# Altium project PCB_Project.PrjPcb
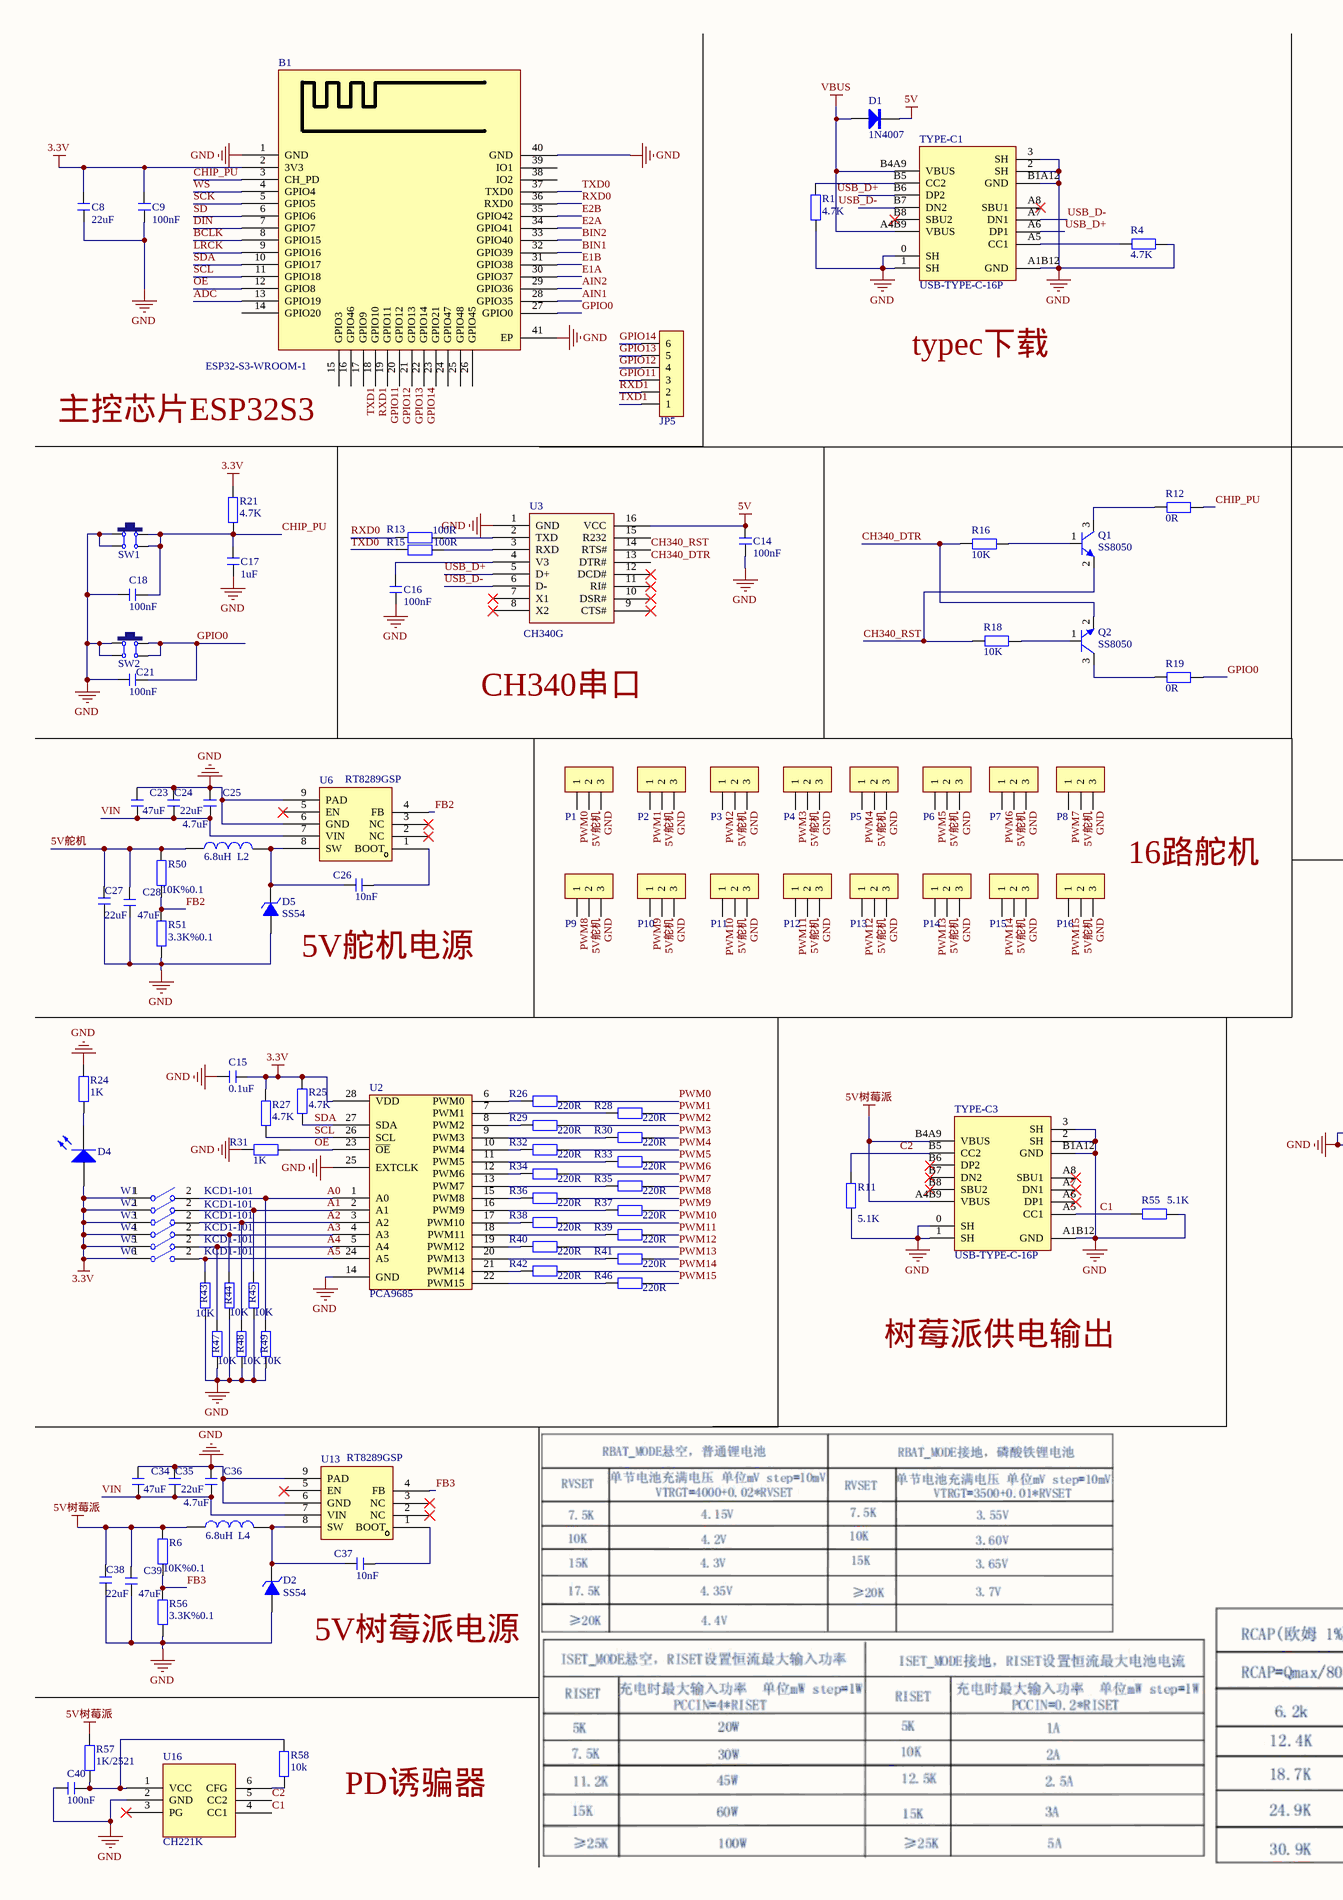
[diagram p0: 1.0v.SchDoc, left]
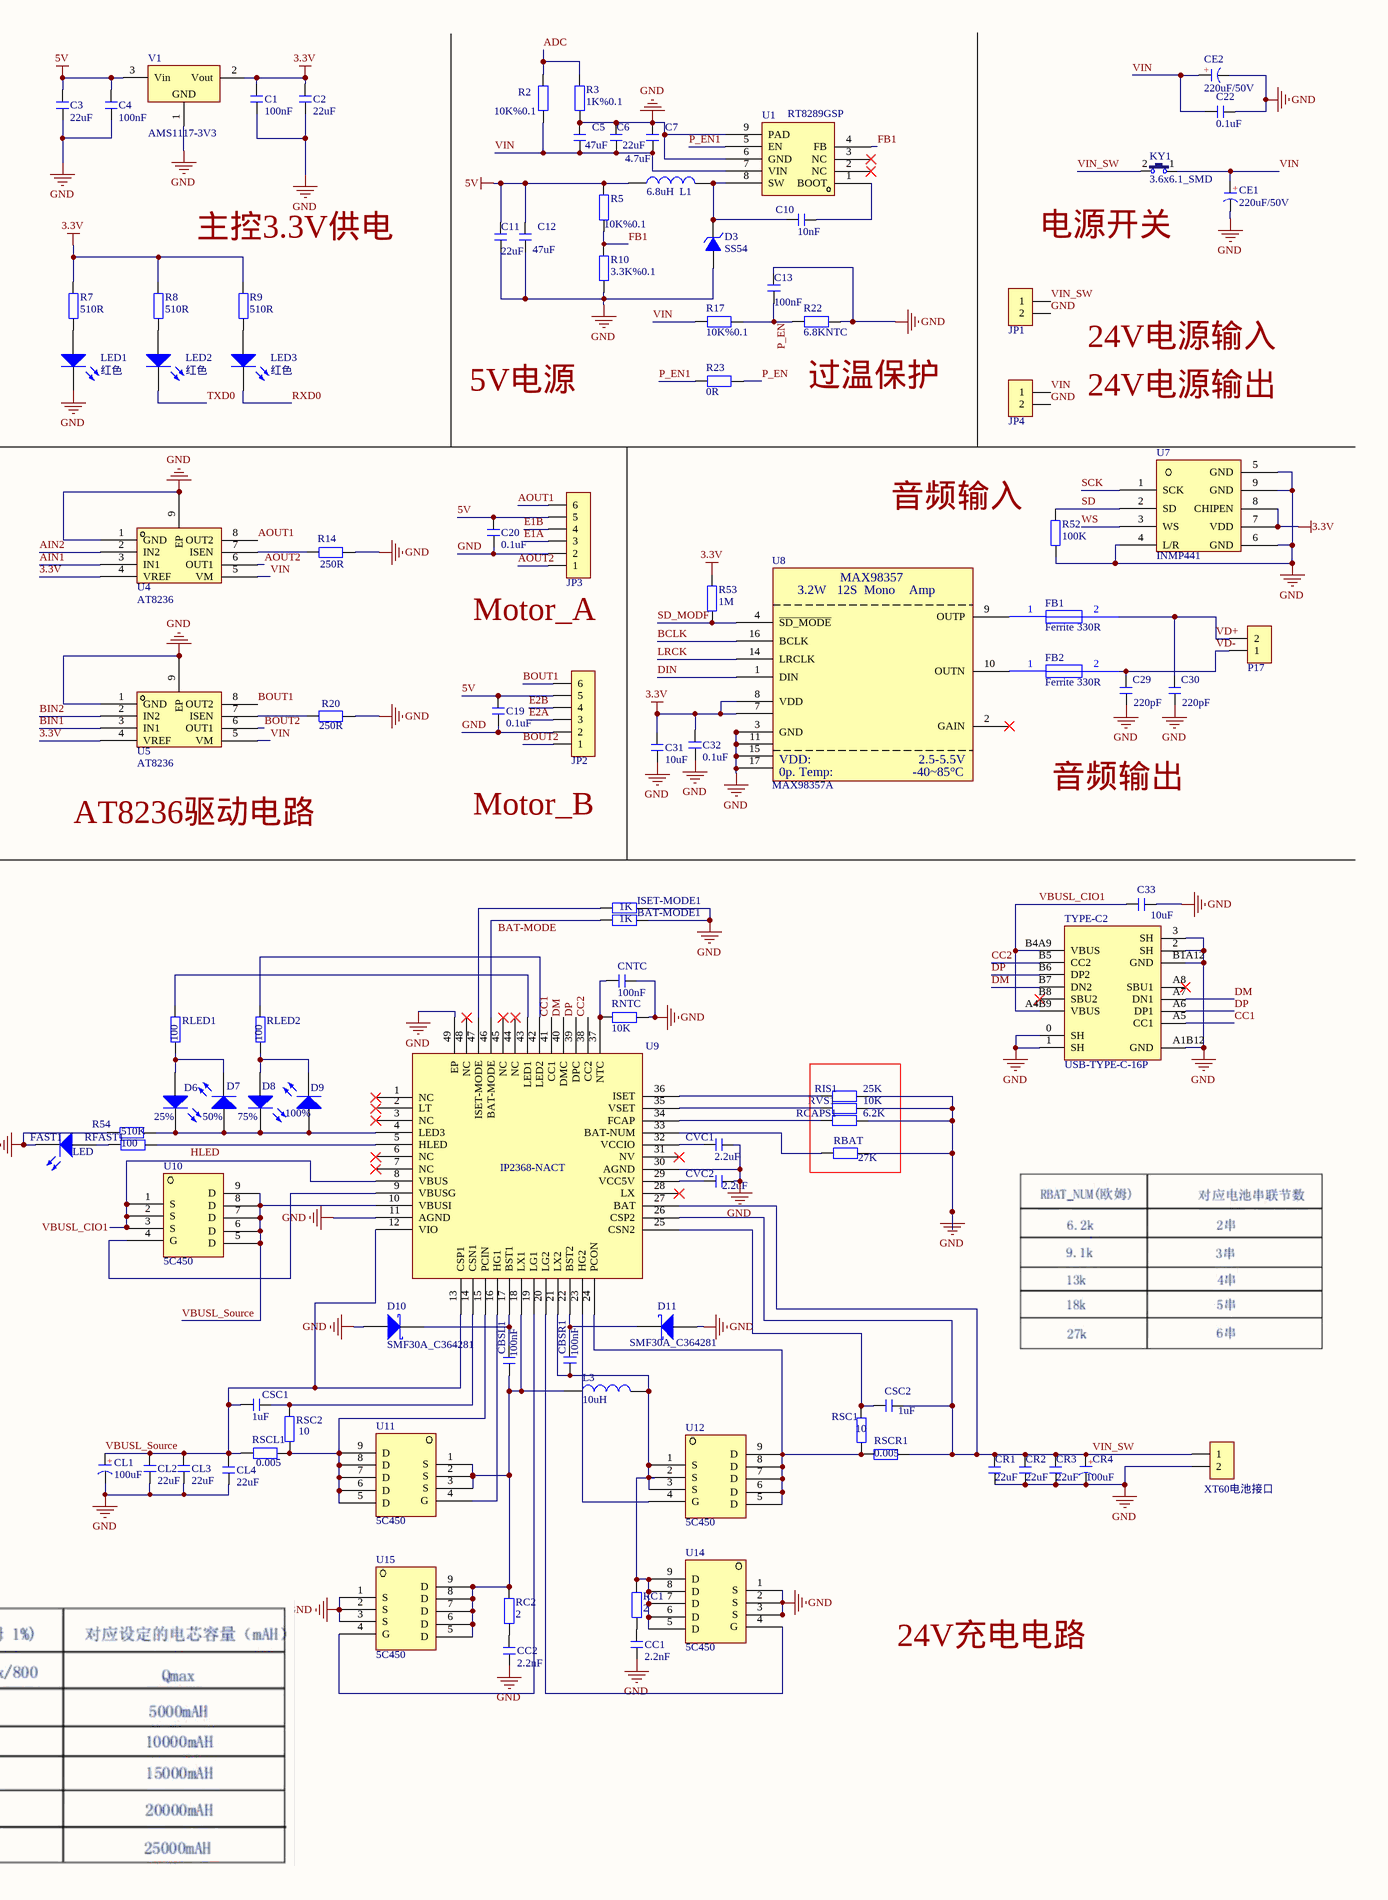
[diagram p1: 1.0v.SchDoc, right]
1 sheet, 209 parts. Net scope: global (net labels, ports and power ports of the same name join across sheets).
Board file: PCB1.PcbDoc

## Sheet 1.0v.SchDoc
size A2; SheetNumber: 1; SheetTotal: 1

### Parts
B1  ESP32-S3-WROOM-1  [WIFIM-SMD_ESP32-WROOM-32D]
BAT-MODE1  1K  [R 0603_L]
C1  100nF  [C 0603_L]
C2  22uF  [C 0805_L]
C3  22uF  [C 0805_L]
C4  100nF  [C 0603_L]
C5  47uF  [C 1210_L]
C6  22uF  [C 1210_L]
C7  4.7uF  [C 0603_L]
C8  22uF  [C 0805_L]
C9  100nF  [C 0603_L]
C10  10nF  [C 0603_L]
C11  22uF  [C 0805_L]
C12  47uF  [C 0805_L]
C13  100nF  [C 0603_L]
C14  100nF  [C 0603_L]
C15  0.1uF  [C 0603_L]
C16  100nF  [C 0603_L]
C17  1uF  [C 0603_L]
C18  100nF  [C 0603_L]
C19  0.1uF  [C 0603_L]
C20  0.1uF  [C 0603_L]
C21  100nF  [C 0603_L]
C22  0.1uF  [C 0603_L]
C23  47uF  [C 1210_L]
C24  22uF  [C 1210_L]
C25  4.7uF  [C 0603_L]
C26  10nF  [C 0603_L]
C27  22uF  [C 0805_L]
C28  47uF  [C 0805_L]
C29  220pF  [C 0603_L]
C30  220pF  [C 0603_L]
C31  10uF  [C 0603_L]
C32  0.1uF  [C 0603_L]
C33  10uF  [C 0603_L]
C34  47uF  [C 1210_L]
C35  22uF  [C 1210_L]
C36  4.7uF  [C 0603_L]
C37  10nF  [C 0603_L]
C38  22uF  [C 0805_L]
C39  47uF  [C 0805_L]
C40  100nF  [C 0603_L]
CBSL1  100nF  [C 0603_L]
CBSR1  100nF  [C 0603_L]
CC1  2.2nF  [C 0603_L]
CC2  2.2nF  [C 0603_L]
CE1  220uF/50V  [CM F(10*10.2)]
CE2  220uF/50V  [CM F(10*10.2)]
CL1  100uF  [CM E(8*10.2)]
CL2  22uF  [C 1210_L]
CL3  22uF  [C 1210_L]
CL4  22uF  [C 1210_L]
CNTC  100nF  [C 0603_L]
CR1  22uF  [C 1210_L]
CR2  22uF  [C 1210_L]
CR3  22uF  [C 1210_L]
CR4  100uF  [CM E(8*10.2)]
CSC1  1uF  [C 0603_L]
CSC2  1uF  [C 0603_L]
CVC1  2.2uF  [C 0603_L]
CVC2  2.2uF  [C 0603_L]
D1  1N4007  [SMA]
D2  SS54  [SMA]
D3  SS54  [SMA]
D4  LED  [LED 0603G]  (value not drawn)
D5  SS54  [SMA]
D6  25%  [LED 0603G]
D7  50%  [LED 0603G]
D8  75%  [LED 0603G]
D9  100%  [LED 0603G]
D10  SMF30A_C364281  [SOD-123F]
D11  SMF30A_C364281  [SOD-123F]
FAST1  LED  [LED 0603G]
FB1  Ferrite 330R  [R 0603_L]
FB2  Ferrite 330R  [R 0603_L]
ISET-MODE1  1K  [R 0603_L]
JP1  HDR-1X2  [HDR2.54-M-LI-2P]  (value not drawn)
JP2  HDR-1X6  [HDR2.54-M-LI-6P]  (value not drawn)
JP3  HDR-1X6  [HDR2.54-M-LI-6P]  (value not drawn)
JP4  HDR-1X2  [HDR2.54-M-LI-2P]  (value not drawn)
JP5  HDR-1X6  [HDR2.54-M-LI-6P]  (value not drawn)
KY1  3.6x6.1_SMD  [SS-12F23]
L1  6.8uH  [CD73]
L2  6.8uH  [CD73]
L3  10uH  [PQ2012]
L4  6.8uH  [CD73]
LED1  红色  [LED 0603R]
LED2  红色  [LED 0603R]
LED3  红色  [LED 0603R]
P1  HDR-1X3  [XH2.54-LI-3P]  (value not drawn)
P2  HDR-1X3  [XH2.54-LI-3P]  (value not drawn)
P3  HDR-1X3  [XH2.54-LI-3P]  (value not drawn)
P4  HDR-1X3  [XH2.54-LI-3P]  (value not drawn)
P5  HDR-1X3  [XH2.54-LI-3P]  (value not drawn)
P6  HDR-1X3  [XH2.54-LI-3P]  (value not drawn)
P7  HDR-1X3  [XH2.54-LI-3P]  (value not drawn)
P8  HDR-1X3  [XH2.54-LI-3P]  (value not drawn)
P9  HDR-1X3  [XH2.54-LI-3P]  (value not drawn)
P10  HDR-1X3  [XH2.54-LI-3P]  (value not drawn)
P11  HDR-1X3  [XH2.54-LI-3P]  (value not drawn)
P12  HDR-1X3  [XH2.54-LI-3P]  (value not drawn)
P13  HDR-1X3  [XH2.54-LI-3P]  (value not drawn)
P14  HDR-1X3  [XH2.54-LI-3P]  (value not drawn)
P15  HDR-1X3  [XH2.54-LI-3P]  (value not drawn)
P16  HDR-1X3  [XH2.54-LI-3P]  (value not drawn)
P17  HDR-1X2  [HDR2.54-M-LI-2P]  (value not drawn)
Q1  SS8050  [SOT23]
Q2  SS8050  [SOT23]
R1  4.7K  [R 0603_L]
R2  10K%0.1  [R 0603_L]
R3  1K%0.1  [R 0603_L]
R4  4.7K  [R 0603_L]
R5  10K%0.1  [R 0603_L]
R6  10K%0.1  [R 0603_L]
R7  510R  [R 0603_L]
R8  510R  [R 0603_L]
R9  510R  [R 0603_L]
R10  3.3K%0.1  [R 0603_L]
R11  5.1K  [R 0603_L]
R12  0R  [R 0603_L]
R13  100R  [R 0603_L]
R14  250R  [R 0603_L]
R15  100R  [R 0603_L]
R16  10K  [R 0603_L]
R17  10K%0.1  [R 0603_L]
R18  10K  [R 0603_L]
R19  0R  [R 0603_L]
R20  250R  [R 0603_L]
R21  4.7K  [R 0603_L]
R22  6.8KNTC  [R 0603_L]
R23  0R  [R 0603_L]
R24  1K  [R 0603_L]
R25  4.7K  [R 0603_L]
R26  220R  [R 0603_L]
R27  4.7K  [R 0603_L]
R28  220R  [R 0603_L]
R29  220R  [R 0603_L]
R30  220R  [R 0603_L]
R31  1K  [R 0603_L]
R32  220R  [R 0603_L]
R33  220R  [R 0603_L]
R34  220R  [R 0603_L]
R35  220R  [R 0603_L]
R36  220R  [R 0603_L]
R37  220R  [R 0603_L]
R38  220R  [R 0603_L]
R39  220R  [R 0603_L]
R40  220R  [R 0603_L]
R41  220R  [R 0603_L]
R42  220R  [R 0603_L]
R43  10K  [R 0603_L]
R44  10K  [R 0603_L]
R45  10K  [R 0603_L]
R46  220R  [R 0603_L]
R47  10K  [R 0603_L]
R48  10K  [R 0603_L]
R49  10K  [R 0603_L]
R50  10K%0.1  [R 0603_L]
R51  3.3K%0.1  [R 0603_L]
R52  100K  [R 0603_L]
R53  1M  [R 0603_L]
R54  510K  [R 0603_L]
R55  5.1K  [R 0603_L]
R56  3.3K%0.1  [R 0603_L]
R57  1K/2521  [R 2512_L]
R58  10k  [R 0603_L]
RBAT  27K  [R 0603_L]
RC1  2  [R 0603_L]
RC2  2  [R 0603_L]
RCAPS1  6.2K  [R 0603_L]
RFAST1  100  [R 0603_L]
RIS1  25K  [R 0603_L]
RLED1  100  [R 0603_L]
RLED2  100  [R 0603_L]
RNTC  10K  [R 0603_L]
RSC1  10  [R 0603_L]
RSC2  10  [R 0603_L]
RSCL1  0.005  [R 2512_L]
RSCR1  0.005  [R 2512_L]
RVS1  10K  [R 0603_L]
SW1  6x6x5  [TSW SMD-6*6*5]  (value not drawn)
SW2  6x6x5  [TSW SMD-6*6*5]  (value not drawn)
TYPE-C1  USB-TYPE-C-16P  [USB-C-SMD_TYPE-C16PIN-SHOUHAN]
TYPE-C2  USB-TYPE-C-16P  [USB-C-SMD_TYPE-C16PIN-SHOUHAN]
TYPE-C3  USB-TYPE-C-16P  [USB-C-SMD_TYPE-C16PIN-SHOUHAN]
U1  RT8289GSP  [SOP8]
U2  PCA9685  [TSSOP-28]
U3  CH340G  [SOP16]
U4  AT8236  [SOP8]
U5  AT8236  [SOP8]
U6  RT8289GSP  [SOP8]
U7  INMP441  [INMP441]
U8  MAX98357A  [QFN16]
U9  IP2368-NACT  [QFN48 7X7_L]
U10  5C450  [5C450L]
U11  5C450  [5C450L]
U12  5C450  [5C450L]
U13  RT8289GSP  [SOP8]
U14  5C450  [5C450L]
U15  5C450  [5C450L]
U16  CH221K  [SOT23-6L]
V1  AMS1117-3V3  [SOT-223]
W1  KCD1-101  [R 0603_L]
W2  KCD1-101  [R 0603_L]
W3  KCD1-101  [R 0603_L]
W4  KCD1-101  [R 0603_L]
W5  KCD1-101  [R 0603_L]
W6  KCD1-101  [R 0603_L]
XT60电池接口  HDR-1X2  [TX60-LI-S]  (value not drawn)

### Nets
3.3V: B1.2(3V3) C1.2 C2.2 C8.1 C9.1 C15.2 C31.2 C32.2 D4.1(A) R7.2 R8.2 R9.2 R21.2 R25.2 R27.2 R53.1 U2.28(VDD) U4.4(VREF) U5.4(VREF) U7.7(VDD) U7.8(CHIPEN) U8.7(VDD) U8.8(VDD) V1.2(Vout) W1.1 W2.1 W3.1 W4.1 W5.1 W6.1
5V: C3.2 C4.2 C11.1 C12.1 C14.2 C19.2 C20.2 D1.2(K) JP2.5 JP3.5 L1.1 R5.1 U3.16(VCC) V1.3(Vin)
5V树莓派: C38.1 C39.1 L4.1 R6.1 R57.2 TYPE-C3.A4B9(VBUS) TYPE-C3.B4A9(VBUS)
GND: B1.1(GND) B1.40(GND) B1.41(EP) BAT-MODE1.2 C1.1 C2.1 C3.1 C4.1 C5.1 C6.1 C7.1 C8.2 C9.2 C11.2 C12.2 C13.1 C14.1 C15.1 C16.1 C17.2 C18.2 C19.1 C20.1 C21.2 C22.2 C23.1 C24.1 C25.1 C27.2 C28.2 C29.1 C30.1 C31.1 C32.1 C33.2 C34.1 C35.1 C36.1 C38.2 C39.2 C40.1 CC1.1 CC2.1 CE1.2(K) CE2.2(K) CL1.2(K) CL2.1 CL3.1 CL4.1 CNTC.2 CR1.1 CR2.1 CR3.1 CR4.2(K) CVC1.2 CVC2.2 D2.1(A) D3.1(A) D5.1(A) D10.1(A) D11.1(A) FAST1.2(K) ISET-MODE1.2 JP1.2 JP2.2 JP3.2 JP4.2 LED1.2(K) P1.3 P2.3 P3.3 P4.3 P5.3 P6.3 P7.3 P8.3 P9.3 P10.3 P11.3 P12.3 P13.3 P14.3 P15.3 P16.3 R1.1 R3.2 R4.1 R10.2 R11.1 R14.2 R20.2 R22.2 R24.2 R31.1 R43.1 R44.1 R45.1 R47.1 R48.1 R49.1 R51.2 R52.1 R54.1 R55.1 R56.2 RBAT.2 RCAPS1.2 RIS1.2 RNTC.2 RVS1.2 SW1.1 SW1.4 SW2.1 SW2.4 TYPE-C1.0(SH) TYPE-C1.1(SH) TYPE-C1.2(SH) TYPE-C1.3(SH) TYPE-C1.A1B12(GND) TYPE-C1.B1A12(GND) TYPE-C2.0(SH) TYPE-C2.1(SH) TYPE-C2.2(SH) TYPE-C2.3(SH) TYPE-C2.A1B12(GND) TYPE-C2.B1A12(GND) TYPE-C3.0(SH) TYPE-C3.1(SH) TYPE-C3.2(SH) TYPE-C3.3(SH) TYPE-C3.A1B12(GND) TYPE-C3.B1A12(GND) U1.6(GND) U1.9(PAD) U2.14(GND) U2.25(EXTCLK) U3.1(GND) U4.1(GND) U4.9(EP) U5.1(GND) U5.9(EP) U6.6(GND) U6.9(PAD) U7.4(L/R) U7.5(GND) U7.6(GND) U7.9(GND) U8.3(GND) U8.11(GND) U8.15(GND) U8.17(GND) U9.11(AGND) U9.30(AGND) U9.49(EP) U13.6(GND) U13.9(PAD) U14.1(S) U14.2(S) U14.3(S) U15.1(S) U15.2(S) U15.3(S) U16.2(GND) V1.1(GND) XT60电池接口.2
VBUS: D1.1(A) TYPE-C1.A4B9(VBUS) TYPE-C1.B4A9(VBUS)
5V舵机: C27.1 C28.1 L2.1 P1.2 P2.2 P3.2 P4.2 P5.2 P6.2 P7.2 P8.2 P9.2 P10.2 P11.2 P12.2 P13.2 P14.2 P15.2 P16.2 R50.1
A0: R49.2 U2.1(A0) W1.2
A1: R45.2 U2.2(A1) W2.2
A2: R48.2 U2.3(A2) W3.2
A3: R44.2 U2.4(A3) W4.2
A4: R47.2 U2.5(A4) W5.2
A5: R43.2 U2.24(A5) W6.2
ADC: B1.13(GPIO19) R2.1 R3.1
AIN1: B1.28(GPIO35) U4.3(IN1)
AIN2: B1.29(GPIO36) U4.2(IN2)
AOUT1: JP3.6 U4.8(OUT2)
AOUT2: JP3.1 U4.6(OUT1)
BAT-MODE: BAT-MODE1.1 U9.46(BAT-MODE)
BCLK: B1.8(GPIO15) U8.16(BCLK)
BIN1: B1.32(GPIO39) U5.3(IN1)
BIN2: B1.33(GPIO40) U5.2(IN2)
BOUT1: JP2.6 U5.8(OUT2)
BOUT2: JP2.1 U5.6(OUT1)
C1: R55.2 TYPE-C3.A5(CC1) U16.4(CC1)
C2: R11.2 TYPE-C3.B5(CC2) U16.5(CC2)
CC1: TYPE-C2.A5(CC1) U9.41(CC1)
CC2: TYPE-C2.B5(CC2) U9.38(CC2)
CH340_DTR: Q2.2(E) R16.2 U3.13(DTR#)
CH340_RST: Q1.2(E) R18.2 U3.14(RTS#)
CHIP_PU: B1.3(CH_PD) C17.1 C18.1 R12.1 R21.1 SW1.2 SW1.3
DIN: B1.7(GPIO7) U8.1(DIN)
DM: TYPE-C2.A7(DN1) TYPE-C2.B7(DN2) U9.40(DMC)
DP: TYPE-C2.A6(DP1) TYPE-C2.B6(DP2) U9.39(DPC)
E1A: B1.30(GPIO37) JP3.3
E1B: B1.31(GPIO38) JP3.4
E2A: B1.34(GPIO41) JP2.3
E2B: B1.35(GPIO42) JP2.4
FB1: R5.2 R10.1 U1.4(FB)
FB2: R50.2 R51.1 U6.4(FB)
FB3: R6.2 R56.1 U13.4(FB)
GPIO0: B1.27(GPIO0) C21.1 R19.1 SW2.2 SW2.3
GPIO11: B1.19(GPIO11) JP5.3
GPIO12: B1.20(GPIO12) JP5.4
GPIO13: B1.21(GPIO13) JP5.5
GPIO14: B1.22(GPIO14) JP5.6
HLED: RFAST1.2 U9.5(HLED)
LRCK: B1.9(GPIO16) U8.14(LRCLK)
OE: B1.12(GPIO8) R31.2 U2.23(~{OE})
P_EN: C13.2 R17.2 R22.1 R23.2
P_EN1: R23.1 U1.5(EN)
PWM0: P1.1 R26.1
PWM1: P2.1 R28.2
PWM2: P3.1 R29.2
PWM3: P4.1 R30.2
PWM4: P5.1 R32.2
PWM5: P6.1 R33.2
PWM6: P7.1 R34.2
PWM7: P8.1 R35.2
PWM8: P9.1 R36.2
PWM9: P10.1 R37.2
PWM10: P11.1 R38.2
PWM11: P12.1 R39.2
PWM12: P13.1 R40.2
PWM13: P14.1 R41.2
PWM14: P15.1 R42.2
PWM15: P16.1 R46.2
RXD0: B1.36(RXD0) LED3.2(K) R13.1
RXD1: B1.18(GPIO10) JP5.2
SCK: B1.5(GPIO5) U7.1(SCK)
SCL: B1.11(GPIO18) R27.1 U2.26(SCL)
SD: B1.6(GPIO6) R52.2 U7.2(SD)
SD_MODF: R53.2 U8.4(~{SD_MODE})
SDA: B1.10(GPIO17) R25.1 U2.27(SDA)
TXD0: B1.37(TXD0) LED2.2(K) R15.1
TXD1: B1.17(GPIO9) JP5.1
USB_D+: TYPE-C1.A6(DP1) TYPE-C1.B6(DP2) U3.5(D+)
USB_D-: TYPE-C1.A7(DN1) TYPE-C1.B7(DN2) U3.6(D-)
VBUSL_CIO1: C33.1 TYPE-C2.A4B9(VBUS) TYPE-C2.B4A9(VBUS) U9.8(VBUS) U10.1(S) U10.2(S) U10.3(S)
VBUSL_Source: CL1.1(A) CL2.2 CL3.2 CL4.2 CSC1.1 RSCL1.2 U9.10(VBUSI) U9.12(VIO) U9.13(CSP1) U10.5(D) U10.6(D) U10.7(D) U10.8(D) U10.9(D)
VD+: C30.2 FB1.2 P17.2
VD-: C29.2 FB2.2 P17.1
VIN: C5.2 C6.2 C7.2 C22.1 C23.2 C24.2 C25.2 C34.2 C35.2 C36.2 CE1.1(A) CE2.1(A) JP4.1 KY1.1 R2.2 R17.1 U1.7(VIN) U4.5(VM) U5.5(VM) U6.7(VIN) U13.7(VIN)
VIN_SW: CR1.2 CR2.2 CR3.2 CR4.1(A) CSC2.2 JP1.1 KY1.2 RSCR1.2 U9.26(CSP2) U9.27(BAT) XT60电池接口.1
WS: B1.4(GPIO4) U7.3(WS)
NetC10_1: C10.1 D3.2(K) L1.2 U1.8(SW)
NetC10_2: C10.2 U1.1(BOOT)
NetC16_2: C16.2 U3.4(V3)
NetC26_1: C26.1 D5.2(K) L2.2 U6.8(SW)
NetC26_2: C26.2 U6.1(BOOT)
NetC37_1: C37.1 D2.2(K) L4.2 U13.8(SW)
NetC37_2: C37.2 U13.1(BOOT)
NetC40_2: C40.2 R57.1 R58.2 U16.1(VCC)
NetCBSL1_1: CBSL1.1 L3.1 RC2.1 U9.18(LX1) U11.1(S) U11.2(S) U11.3(S) U15.5(D) U15.6(D) U15.7(D) U15.8(D) U15.9(D)
NetCBSL1_2: CBSL1.2 D10.2(K) U9.17(BST1)
NetCBSR1_1: CBSR1.1 D11.2(K) U9.22(BST2)
NetCBSR1_2: CBSR1.2 L3.2 RC1.1 U9.21(LX2) U12.1(S) U12.2(S) U12.3(S) U14.5(D) U14.6(D) U14.7(D) U14.8(D) U14.9(D)
NetCC1_2: CC1.2 RC1.2
NetCC2_2: CC2.2 RC2.2
NetCNTC_1: CNTC.1 RNTC.1 U9.37(NTC)
NetCSC1_2: CSC1.2 RSC2.2 U9.14(CSN1)
NetCSC2_1: CSC2.1 RSC1.2 U9.25(CSN2)
NetCVC1_1: CVC1.1 U9.32(VCCIO)
NetCVC2_1: CVC2.1 U9.29(VCC5V)
NetD4_2: D4.2(K) R24.1
NetD6_1: D6.1(A) D7.2(K) RLED1.2
NetD6_2: D6.2(K) D7.1(A) D8.2(K) D9.1(A) R54.2 U9.4(LED3)
NetD8_1: D8.1(A) D9.2(K) RLED2.1
NetFAST1_1: FAST1.1(A) RFAST1.1
NetFB1_1: FB1.1 U8.9(OUTP)
NetFB2_1: FB2.1 U8.10(OUTN)
NetISET-MODE1_1: ISET-MODE1.1 U9.47(ISET-MODE)
NetLED1_1: LED1.1(A) R7.1
NetLED2_1: LED2.1(A) R8.1
NetLED3_1: LED3.1(A) R9.1
NetQ1_1: Q1.1(B) R16.1
NetQ1_3: Q1.3(C) R12.2
NetQ2_1: Q2.1(B) R18.1
NetQ2_3: Q2.3(C) R19.2
NetR1_2: R1.2 TYPE-C1.B5(CC2)
NetR4_2: R4.2 TYPE-C1.A5(CC1)
NetR13_2: R13.2 U3.2(TXD)
NetR14_1: R14.1 U4.7(ISEN)
NetR15_2: R15.2 U3.3(RXD)
NetR20_1: R20.1 U5.7(ISEN)
NetR26_2: R26.2 U2.6(PWM0)
NetR28_1: R28.1 U2.7(PWM1)
NetR29_1: R29.1 U2.8(PWM2)
NetR30_1: R30.1 U2.9(PWM3)
NetR32_1: R32.1 U2.10(PWM4)
NetR33_1: R33.1 U2.11(PWM5)
NetR34_1: R34.1 U2.12(PWM6)
NetR35_1: R35.1 U2.13(PWM7)
NetR36_1: R36.1 U2.15(PWM8)
NetR37_1: R37.1 U2.16(PWM9)
NetR38_1: R38.1 U2.17(PWM10)
NetR39_1: R39.1 U2.18(PWM11)
NetR40_1: R40.1 U2.19(PWM12)
NetR41_1: R41.1 U2.20(PWM13)
NetR42_1: R42.1 U2.21(PWM14)
NetR46_1: R46.1 U2.22(PWM15)
NetR58_1: R58.1 U16.6(CFG)
NetRBAT_1: RBAT.1 U9.33(BAT-NUM)
NetRCAPS1_1: RCAPS1.1 U9.34(FCAP)
NetRIS1_1: RIS1.1 U9.36(ISET)
NetRLED1_1: RLED1.1 U9.43(LED1)
NetRLED2_2: RLED2.2 U9.42(LED2)
NetRSC1_1: RSC1.1 RSCR1.1 U9.24(PCON) U12.5(D) U12.6(D) U12.7(D) U12.8(D) U12.9(D)
NetRSC2_1: RSC2.1 RSCL1.1 U9.15(PCIN) U11.5(D) U11.6(D) U11.7(D) U11.8(D) U11.9(D)
NetRVS1_1: RVS1.1 U9.35(VSET)
NetU9_9: U9.9(VBUSG) U10.4(G)
NetU9_16: U9.16(HG1) U11.4(G)
NetU9_19: U9.19(LG1) U15.4(G)
NetU9_20: U9.20(LG2) U14.4(G)
NetU9_23: U9.23(HG2) U12.4(G)

Not connected (* = marked no-connect by the designer): B1 14(GPIO20) 15(GPIO3) 16(GPIO46) 23(GPIO21) 24(GPIO47) 25(GPIO48) 26(GPIO45) 38(IO2) 39(IO1); TYPE-C1 A8(SBU1)* B8(SBU2)*; TYPE-C2 A8(SBU1)* B8(SBU2)*; TYPE-C3 A6(DP1)* A7(DN1)* A8(SBU1)* B6(DP2)* B7(DN2)* B8(SBU2)*; U1 2(NC)* 3(NC)*; U3 7(X1)* 8(X2)* 9(CTS#)* 10(DSR#)* 11(RI#)* 12(DCD#)* 15(R232); U6 2(NC)* 3(NC)* 5(EN)*; U8 2(GAIN)*; U9 1(NC)* 2(LT)* 3(NC)* 6(NC)* 7(NC)* 28(LX)* 31(NV)* 44(NC)* 45(NC)* 48(NC)*; U13 2(NC)* 3(NC)* 5(EN)*; U16 3(PG)*

### Notes on the sheet
- 主控3.3V供电
- 电源开关
- 24V电源输入
- typec下载
- 5V电源
- (near R22) 过温保护
- 24V电源输出
- 主控芯片ESP32S3
- 音频输入
- (near JP3) Motor_A
- CH340串口
- AT8236驱动电路
- (near JP2) Motor_B
- 音频输出
- 16路舵机
- 5V舵机电源
- 树莓派供电输出
- 5V树莓派电源
- 24V充电电路
- PD诱骗器
- (in symbol CE) +
- (in symbol MAX98357A) MAX98357; 3.2W   12S  Mono    Amp; VDD:; 2.5-5.5V; 0p. Temp:; -40~85°C

### Library data of the parts
BAT-MODE1 ISET-MODE1 R1-R58 RBAT RC1 RC2 RCAPS1 RFAST1 RIS1 RLED1 RLED2 RNTC RSC1 RSC2 RSCL1 RSCR1 RVS1 = R: 贴片电阻; 版权归属: 来自淘宝 ID：黄晶宝石; 封装库来自淘宝卖家 ID：黄晶宝石: 其他店铺购入均为盗版，不享受售后技术支持服务，请立即申请退款; BOM名称: 贴片电阻; 联系售后: https://item.taobao.com/item.htm?id=566775463719
C1-C40 CBSL1 CBSR1 CC1 CC2 CL2-CL4 CNTC CR1-CR3 CSC1 CSC2 CVC1 CVC2 = C: 贴片电容; BOM名称: 无极性贴片电容; 淘宝ID: 封装库来自淘宝 ID：黄晶宝石; 联系售后，技术支持: https://shop463601444.taobao.com; 唯一出售店铺网址: https://shop463601444.taobao.com
CE1 CE2 CL1 CR4 = CE: 直插电解电容; 淘宝ID: 封装库来自淘宝 ID：黄晶宝石; BOM名称: 直插电解电容; 联系售后: https://item.taobao.com/item.htm?id=566775463719
D1 = 1N4007: 整流二极管; 淘宝ID: 封装库来自淘宝 ID：黄晶宝石; 封装库来自淘宝卖家 ID：黄晶宝石: 其他店铺购入均为盗版，不享受售后技术支持服务，请立即申请退款; BOM名称: 整流二极管; 联系售后，技术支持: https://shop463601444.taobao.com
D2 D3 D5 = 1N4106: 12V/0.5W稳压管; 版权归属: 封装库来自淘宝 ID：黄晶宝石; BOM名称: 12V/0.5W稳压管; 学习资源: https://item.taobao.com/item.htm?id=566775463719
D4 D6-D9 FAST1 = LED: 发光二极管; 版权归属: 封装库来自淘宝 ID：黄晶宝石; 技术支持，联系售后: https://item.taobao.com/item.htm?id=566775463719
D10 D11 = SS14: 肖特基二极管; 属性: 40V/1A; BOM名称: 肖特基二极管; 封装库来自淘宝 ID：黄晶宝石: https://shop463601444.taobao.com
FB1 FB2 = Ferrite
JP1 JP4 P17 XT60电池接口 = Header 2: 2P接插件; 版权归属: 封装库来自淘宝 ID：黄晶宝石; BOM名称: 2P接插件
JP2 JP3 JP5 = Header 6: 6P接插件; 学习资源: 最新版本发布https://item.taobao.com/item.htm?id=566775463719; 版权归属: 封装库来自淘宝 ID：黄晶宝石; BOM名称: 6P接插件
KY1 = TSW DIP-6x6_V: 侧按直插6x6轻触开关; 版权归属: 封装库来自淘宝 ID：黄晶宝石; BOM名称: 直插6x6轻触开关; 技术支持，联系售后: https://shop463601444.taobao.com
L1-L4 = L-AL: 色环电感; 淘宝ID: 封装库来自淘宝 ID：黄晶宝石; BOM名称: 色环电感
LED1-LED3 = LED-5MM: 直插5mm LED; BOM名称: 5mm插件LED; 版权归属: 封装库来自淘宝 ID：黄晶宝石; 学习资源: https://item.taobao.com/item.htm?id=566775463719
P1-P16 = Header 3: 3P接插件; 版权归属: 封装库来自淘宝 ID：黄晶宝石; 学习资源: 最新版本发布https://item.taobao.com/item.htm?id=566775463719; BOM名称: 3P接插件
Q1 Q2 = 8050-SMD: 高频放大-NPN型; 联系售后: 最新版本发布https://item.taobao.com/item.htm?id=566775463719; 版权归属: 封装库来自淘宝 ID：黄晶宝石; 属性: 40V 1.5A 1W 100MHZ; BOM名称: 高频放大-NPN型
SW1 SW2 = TSW DIP-6x6: 直插6x6轻触开关; 版权归属: 封装库来自淘宝 ID：黄晶宝石; BOM名称: 直插6x6轻触开关; 唯一出售店铺网址: https://shop463601444.taobao.com
TYPE-C1-TYPE-C3 = USB-TYPE-C
U3 = CH340G: 技术支持，联系售后: 封装库来自淘宝卖家 ID：黄晶宝石; 唯一出售店铺网址: https://shop463601444.taobao.com
U7 = 121
U9 = IP2368
U10-U12 U14 U15 = PK616BAQC
V1 = AMS1117: 三端稳压芯片; BOM名称: 稳压芯片; 淘宝ID: 封装库来自淘宝 ID：黄晶宝石; 欢迎光临淘宝店铺: 最新版本发布https://item.taobao.com/item.htm?id=566775463719
W1-W6 = KCD1-101: 1路单刀船型开关; 版权归属: 封装库来自淘宝 ID：黄晶宝石; BOM名称: 1路单刀船型开关; 学习资源: https://shop463601444.taobao.com